# Altium schematic sheet Top.SchDoc
size B; Author: E. Sims; Organization: Let's Build Rockets Inc.; SheetNumber: 1; SheetTotal: 3
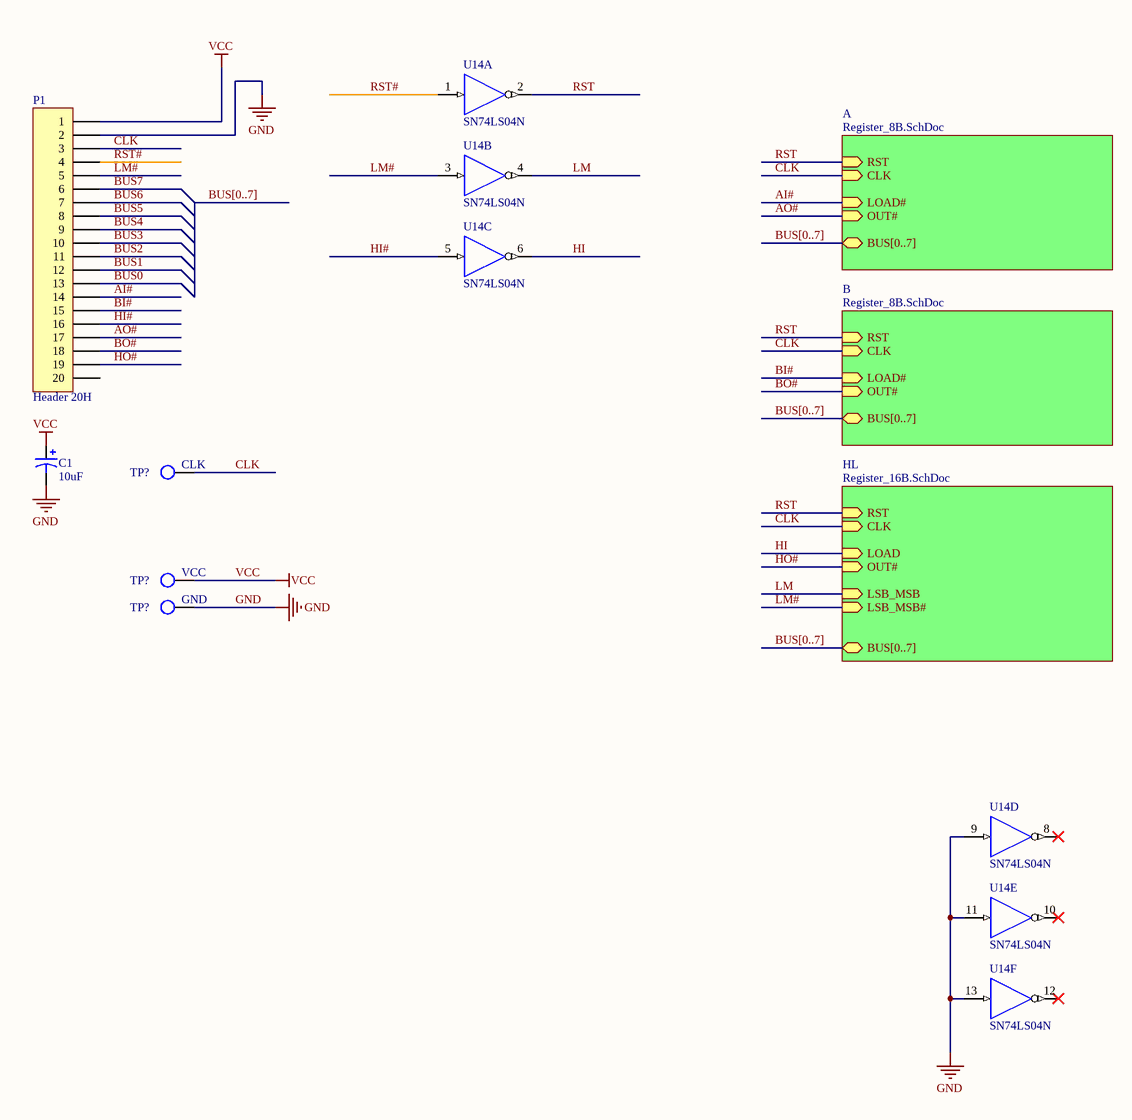
[diagram p0: Top.SchDoc]

## Parts
(Parts that share a designator on the sheet are numbered #1, #2 ... from top to bottom, then left to right.)
C1  value 10uF  [C5x7]  (hidden comment: Cap Pol5)
P1  Header 20H  [HDR1X20H]
TP?#1  CLK  [KSTN-5011_V]  (no BOM)
TP?#2  VCC  [KSTN-5011_V]  (no BOM)
TP?#3  GND  [KSTN-5011_V]  (no BOM)
U14  SN74LS04N  [N014]  (parts A,B,C,D,E,F of 6)

## Sub-sheets
A = Register_8B.SchDoc: RST (in), BUS[0..7] (bidir), CLK (in), OUT# (in), LOAD# (in)
B = Register_8B.SchDoc: RST (in), BUS[0..7] (bidir), CLK (in), OUT# (in), LOAD# (in)
HL = Register_16B.SchDoc: RST (in), BUS[0..7] (bidir), CLK (in), OUT# (in), LOAD (in), LSB_MSB# (in), LSB_MSB (in)

## Nets
GND: C1.2 P1.2 TP?#3.1 U14.7(GND) U14.9(A) U14.11(A) U14.13(A)
VCC: C1.1 P1.1 TP?#2.1 U14.14(VCC)
AI#: P1.14 ; sheet A/LOAD#
AO#: P1.17 ; sheet A/OUT#
BI#: P1.15 ; sheet B/LOAD#
BO#: P1.18 ; sheet B/OUT#
BUS0: P1.13
BUS1: P1.12
BUS2: P1.11
BUS3: P1.10
BUS4: P1.9
BUS5: P1.8
BUS6: P1.7
BUS7: P1.6
CLK: P1.3 TP?#1.1 ; sheet A/CLK, sheet B/CLK, sheet HL/CLK
HI: U14.6(Y) ; sheet HL/LOAD
HI#: P1.16 U14.5(A)
HO#: P1.19 ; sheet HL/OUT#
LM: U14.4(Y) ; sheet HL/LSB_MSB
LM#: P1.5 U14.3(A) ; sheet HL/LSB_MSB#
RST: U14.2(Y) ; sheet A/RST, sheet B/RST, sheet HL/RST
RST#: P1.4 U14.1(A)

Not connected (* = marked no-connect by the designer): P1 20; U14 8(Y)* 10(Y)* 12(Y)*

## Buses and harness runs
bus BUS[0..7]
bus BUS[0..7] = sheet A/BUS[0..7]
bus BUS[0..7] = sheet B/BUS[0..7]
bus BUS[0..7] = sheet HL/BUS[0..7]

## Notes on the sheet
- Let's Build Rocket's Inc. Modular Paylaod System Based on TMP-010 Rev
  For more information visit https://github.com/LetsBuildRockets/Modular-Payload-System
  This work is licensed under CC BY-NC 4.0. To view a copy of this license, visit https://creativecommons.org/licenses/by-nc/4.0
- Title
- Size:
- Date:
- Assembly Variant:
- B
- Number:
- Time:
- Revision:
- Sheet
- of
- Author:
- File:

## Library data of the parts
C1 = Cap Pol5: Polarized Capacitor; Published: 8-Jun-2000; LatestRevisionDate: 17-Jul-2002; LatestRevisionNote: Re-released for DXP Platform.; PackageReference: POLAR0.8; Publisher: Altium Limited; PackageDescription: Polarized Capacitor; 2 Leads
P1 = Header 20H: Header, 20-Pin, Right Angle; System: Connector; LatestRevisionDate: 17-Jul-2002; LatestRevisionNote: Re-released for DXP Platform.; Publisher: Altium Limited
TP?#1-TP?#3 = TP
U14 = SN74LS04N: Hex Inverter; Published: 8-Jun-2000; LatestRevisionDate: 04-Mar-2005; LatestRevisionNote: Stylized 3D Model Added.; DatasheetVersion: Mar-1988; PackageVersion: Oct-1995; PackageReference: N014; Publisher: Altium Limited; PackageDescription: DIP; 14 Leads; Row Spacing 7.62 mm; Pitch 2.54 mm; ComponentLink1Description: Manufacturer Link; ComponentLink1URL: http://www.ti.com/; ComponentLink2Description: Datasheet; ComponentLink2URL: http://www-s.ti.com/sc/ds/sn74ls04.pdf